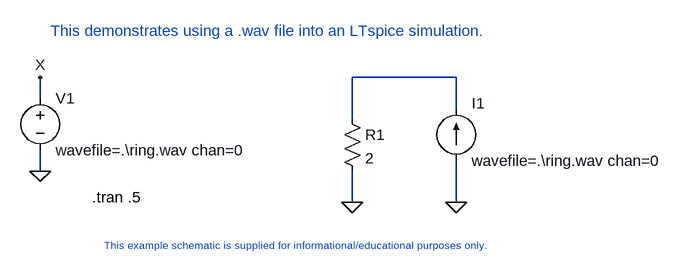
[diagram p0: schematic wavein2.asc]
wavein2.asc, the LTspice schematic file:
Version 4
SHEET 1 2240 1136
WIRE 1824 864 1664 864
WIRE 1184 896 1184 864
WIRE 1824 912 1824 864
WIRE 1664 928 1664 864
WIRE 1184 1008 1184 976
WIRE 1664 1056 1664 1008
WIRE 1824 1056 1824 992
FLAG 1184 1008 0
FLAG 1184 864 X
FLAG 1664 1056 0
FLAG 1824 1056 0
SYMBOL VOLTAGE 1184 880 R0
SYMATTR InstName V1
SYMATTR Value wavefile=.\ring.wav chan=0
SYMBOL current 1824 992 M180
WINDOW 0 24 88 Left 2
WINDOW 3 24 0 Left 2
SYMATTR InstName I1
SYMATTR Value wavefile=.\ring.wav chan=0
SYMBOL res 1648 912 R0
SYMATTR InstName R1
SYMATTR Value 2
TEXT 1264 1048 Left 2 !.tran .5
TEXT 1568 1112 Top 1 ;This example schematic is supplied for informational/educational purposes only.
TEXT 1536 808 Bottom 2 ;This demonstrates using a .wav file into an LTspice simulation.

The netlist it stands for:
* wavein2.asc
V1 X 0 wavefile=.\ring.wav chan=0
I1 0 N001 wavefile=.\ring.wav chan=0
R1 N001 0 2
.tran .5
* This example schematic is supplied for informational/educational purposes only.
* This demonstrates using a .wav file into an LTspice simulation.
.backanno
.end